# Altium schematic sheet current_measurement.SchDoc
size A4; Date: 08.06.2024; ApprovedBy: Jan Macheta; Author: Mikołaj Pichita; SheetNumber: 2; SheetTotal: 8
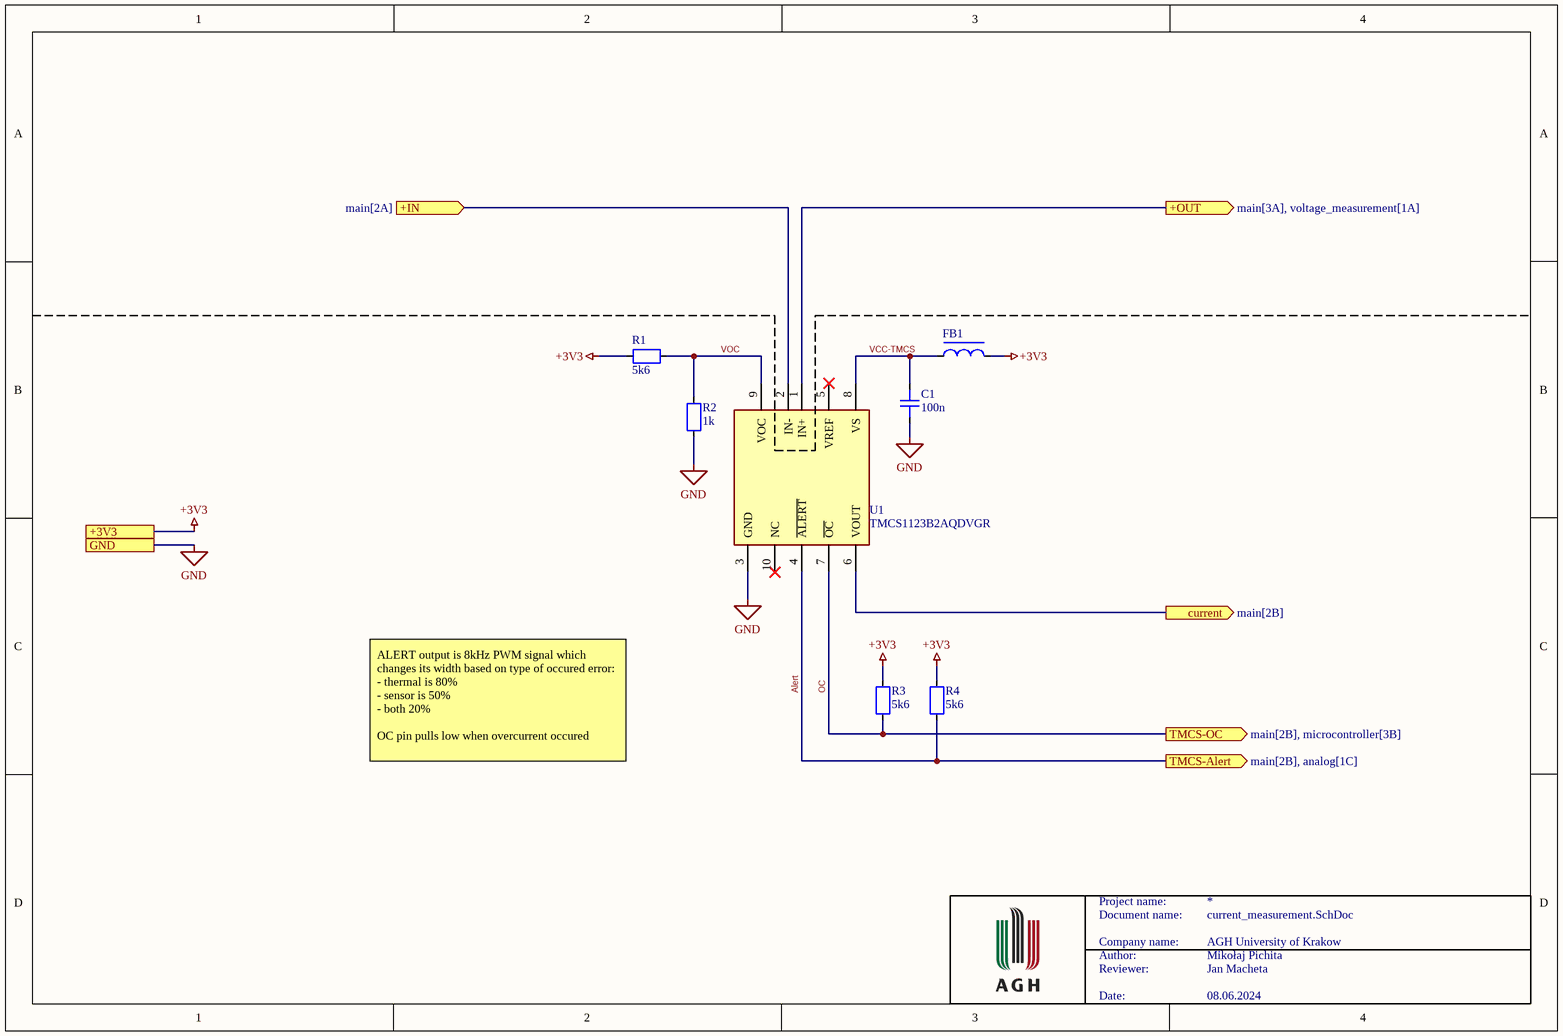
[diagram p0: current_measurement.SchDoc]

## Parts
C1  100n  [CAP0603]
FB1  *  [FB0402]  (value not drawn)
R1  5k6  [RES0603]
R2  1k  [RES0603]
R3  5k6  [RES0603]
R4  5k6  [RES0603]
U1  TMCS1123B2AQDVGR  [FP-DVG0010A-MFG]

## Ports
+3V3 (see main[2A], analog[4A], microcontroller[4A], power[2A], UART[1A], voltage_measurement[4D]), +IN (in, see main[2A]), +OUT (out, see main[3A], voltage_measurement[1A]), current (out, see main[2B]), GND (see main[2B], analog[4A], microcontroller[4A], power[2B], UART[1A], voltage_measurement[4D]), TMCS-Alert (out, see main[2B], analog[1C]), TMCS-OC (out, see main[2B], microcontroller[3B])

## Nets
+3V3: FB1.2 R1.2 R3.1 R4.1 ; port +3V3
GND: C1.2 R2.2 U1.3(GND) ; port GND
+IN: U1.2(IN-) ; port +IN
+OUT: U1.1(IN+) ; port +OUT
Alert: R4.2 U1.4(~{ALERT}) ; port TMCS-Alert
current: U1.6(VOUT) ; port current
OC: R3.2 U1.7(~{OC}) ; port TMCS-OC
VCC-TMCS: C1.1 FB1.1 U1.8(VS)
VOC: R1.1 R2.1 U1.9(VOC)

Not connected (* = marked no-connect by the designer): U1 5(VREF)* 10(NC)*

## Notes on the sheet
- ALERT output is 8kHz PWM signal which changes its width based on type of occured error:
  - thermal is 80%
  - sensor is 50%
  - both 20%
  OC pin pulls low when overcurrent occured
- Project name:
- Document name:
- Company name:
- Author:
- Reviewer:
- AGH University of Krakow
- Date:

## Library data of the parts
C1 = Capacitor: Value: *; HelpURL: *; MPN: *; Supplier: *; SupplierPartNumber: *
FB1 = Ferrite Bead: Value: *; HelpURL: *; MPN: *; Supplier: *; SupplierPartNumber: *
R1-R4 = Resistor: Value: *; HelpURL: *; MPN: *; Supplier: *; SupplierPartNumber: *
U1 = TMCS1123B2AQDVGR: TMCS1123B2AQDVGR ±1300V reinforced isolation, 80Arms 250kHz Hall-effect current sensor with AFR, reference and ALERT 10-SOIC -40 to 125; NexarPartId: 145718629; Manufacturer Lifecycle Status: ACTIVE; Max Junction Temperature (Tj): 165°C; Max Supply Voltage: 5.5V; Operating Supply Current: 11mA; Sensing Method: Hall Effect; Coil Resistance: 700µΩ; Min Supply Voltage: 3V; Accuracy: 0.1%; Lifecycle Status: Production; Height: 0m; Length: 10.3mm; Number of Pins: 10; Min Operating Temperature: -40°C; Thickness: 2.35mm; Width: 7.5mm; Case/Package: SOIC; Max Operating Temperature: 125°C; Ambient Temperature Range High: 125°C